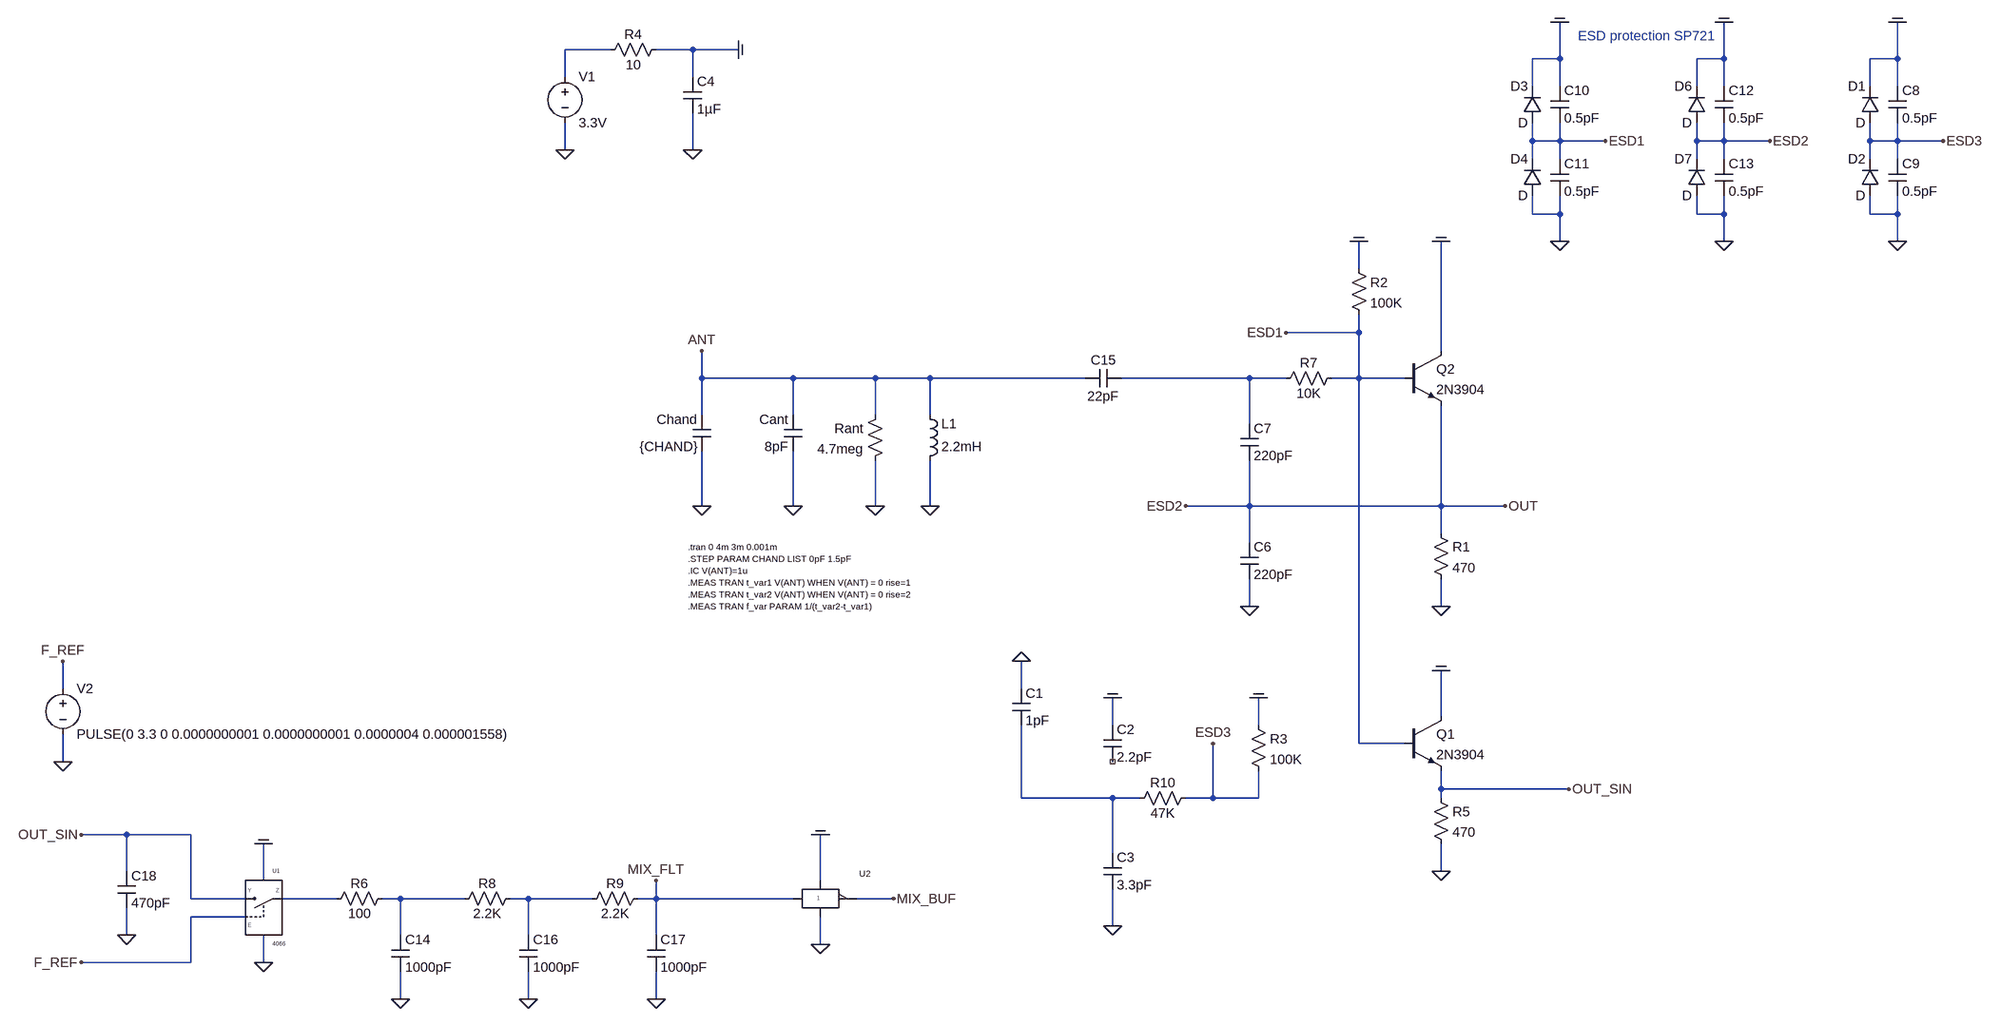
[diagram p0: schematic 2020_analog_oscill_sin_33v_v05_heter.asc]
2020_analog_oscill_sin_33v_v05_heter.asc, the LTspice schematic file:
Version 4
SHEET 1 2908 1572
WIRE -1232 -384 -1312 -384
WIRE -1088 -384 -1152 -384
WIRE -1008 -384 -1088 -384
WIRE 432 -368 432 -432
WIRE 432 -368 384 -368
WIRE 720 -368 720 -432
WIRE 720 -368 672 -368
WIRE 1024 -368 1024 -432
WIRE 1024 -368 976 -368
WIRE -1312 -336 -1312 -384
WIRE -1088 -336 -1088 -384
WIRE 384 -320 384 -368
WIRE 432 -320 432 -368
WIRE 672 -320 672 -368
WIRE 720 -320 720 -368
WIRE 976 -320 976 -368
WIRE 1024 -320 1024 -368
WIRE 384 -224 384 -256
WIRE 432 -224 432 -256
WIRE 432 -224 384 -224
WIRE 512 -224 432 -224
WIRE 672 -224 672 -256
WIRE 720 -224 720 -256
WIRE 720 -224 672 -224
WIRE 800 -224 720 -224
WIRE 976 -224 976 -256
WIRE 1024 -224 1024 -256
WIRE 1024 -224 976 -224
WIRE 1104 -224 1024 -224
WIRE -1312 -208 -1312 -256
WIRE -1088 -208 -1088 -272
WIRE 384 -192 384 -224
WIRE 432 -192 432 -224
WIRE 672 -192 672 -224
WIRE 720 -192 720 -224
WIRE 976 -192 976 -224
WIRE 1024 -192 1024 -224
WIRE 384 -96 384 -128
WIRE 432 -96 432 -128
WIRE 432 -96 384 -96
WIRE 672 -96 672 -128
WIRE 720 -96 720 -128
WIRE 720 -96 672 -96
WIRE 976 -96 976 -128
WIRE 1024 -96 1024 -128
WIRE 1024 -96 976 -96
WIRE 432 -48 432 -96
WIRE 720 -48 720 -96
WIRE 1024 -48 1024 -96
WIRE 80 0 80 -48
WIRE 80 112 80 80
WIRE 80 112 -48 112
WIRE 224 144 224 -48
WIRE -1072 192 -1072 144
WIRE -912 192 -1072 192
WIRE -768 192 -912 192
WIRE -672 192 -768 192
WIRE -400 192 -672 192
WIRE -112 192 -336 192
WIRE -48 192 -112 192
WIRE 80 192 80 112
WIRE 80 192 32 192
WIRE 160 192 80 192
WIRE -1072 256 -1072 192
WIRE -912 256 -912 192
WIRE -768 256 -768 192
WIRE -672 256 -672 192
WIRE -112 272 -112 192
WIRE -1072 416 -1072 320
WIRE -912 416 -912 320
WIRE -768 416 -768 336
WIRE -672 416 -672 336
WIRE -112 416 -112 336
WIRE -112 416 -224 416
WIRE 224 416 224 240
WIRE 224 416 -112 416
WIRE 336 416 224 416
WIRE 224 464 224 416
WIRE -112 480 -112 416
WIRE -112 592 -112 544
WIRE 224 592 224 544
WIRE -2192 736 -2192 688
WIRE -512 736 -512 688
WIRE 224 784 224 704
WIRE -352 800 -352 752
WIRE -96 800 -96 752
WIRE 80 832 80 192
WIRE 160 832 80 832
WIRE -2192 864 -2192 816
WIRE 224 912 224 880
WIRE 448 912 224 912
WIRE -512 928 -512 800
WIRE -352 928 -512 928
WIRE -304 928 -352 928
WIRE -176 928 -176 832
WIRE -176 928 -224 928
WIRE -96 928 -96 880
WIRE -96 928 -176 928
WIRE 224 928 224 912
WIRE -2080 992 -2160 992
WIRE -1968 992 -2080 992
WIRE -352 1024 -352 928
WIRE -2080 1056 -2080 992
WIRE 224 1056 224 1008
WIRE -1840 1072 -1840 1008
WIRE -864 1072 -864 992
WIRE -1968 1104 -1968 992
WIRE -1872 1104 -1968 1104
WIRE -1712 1104 -1808 1104
WIRE -1600 1104 -1632 1104
WIRE -1488 1104 -1600 1104
WIRE -1376 1104 -1408 1104
WIRE -1264 1104 -1376 1104
WIRE -1152 1104 -1152 1072
WIRE -1152 1104 -1184 1104
WIRE -912 1104 -1152 1104
WIRE -736 1104 -800 1104
WIRE -1872 1136 -1968 1136
WIRE -352 1152 -352 1088
WIRE -2080 1168 -2080 1120
WIRE -1600 1168 -1600 1104
WIRE -1376 1168 -1376 1104
WIRE -1152 1168 -1152 1104
WIRE -864 1184 -864 1136
WIRE -1968 1216 -1968 1136
WIRE -1968 1216 -2160 1216
WIRE -1840 1216 -1840 1168
WIRE -1600 1280 -1600 1232
WIRE -1376 1280 -1376 1232
WIRE -1152 1280 -1152 1232
FLAG -1312 -208 0
FLAG -1072 416 0
FLAG -1072 144 ANT
FLAG -768 416 0
FLAG -1008 -384 COM
FLAG 432 -48 0
FLAG 432 -432 COM
FLAG 512 -224 ESD1
FLAG 720 -48 0
FLAG 720 -432 COM
FLAG 800 -224 ESD2
FLAG 1024 -48 0
FLAG 1024 -432 COM
FLAG 1104 -224 ESD3
FLAG -912 416 0
FLAG -352 1152 0
FLAG -48 112 ESD1
FLAG -176 832 ESD3
FLAG -96 752 COM
FLAG -352 752 COM
FLAG 224 1056 0
FLAG 224 704 COM
FLAG 448 912 OUT_SIN
FLAG -1088 -208 0
FLAG -672 416 0
FLAG 224 592 0
FLAG 224 -48 COM
FLAG 336 416 OUT
FLAG 80 -48 COM
FLAG -112 592 0
FLAG -224 416 ESD2
FLAG -2160 992 OUT_SIN
FLAG -2160 1216 F_REF
FLAG -1840 1008 COM
FLAG -1840 1216 0
FLAG -1600 1280 0
FLAG -1376 1280 0
FLAG -1152 1280 0
FLAG -1152 1072 MIX_FLT
FLAG -2192 864 0
FLAG -2192 688 F_REF
FLAG -2080 1168 0
FLAG -864 992 COM
FLAG -864 1184 0
FLAG -736 1104 MIX_BUF
FLAG -512 688 0
SYMBOL voltage -1312 -352 R0
WINDOW 123 0 0 Left 2
WINDOW 39 0 0 Left 2
SYMATTR InstName V1
SYMATTR Value 3.3V
SYMBOL ind -688 352 M180
WINDOW 0 36 80 Left 2
WINDOW 3 36 40 Left 2
SYMATTR InstName L1
SYMATTR Value 2.2mH
SYMATTR SpiceLine Ipk=0.1 Rser=69 Rpar=1.536Meg Cpar=1.147pF
SYMBOL cap -1056 256 M0
SYMATTR InstName Chand
SYMATTR Value {CHAND}
SYMBOL res -752 240 M0
SYMATTR InstName Rant
SYMATTR Value 4.7meg
SYMBOL diode 400 -256 R180
WINDOW 0 24 64 Left 2
WINDOW 3 24 0 Left 2
SYMATTR InstName D3
SYMBOL diode 400 -128 R180
WINDOW 0 24 64 Left 2
WINDOW 3 24 0 Left 2
SYMATTR InstName D4
SYMBOL cap 416 -320 R0
SYMATTR InstName C10
SYMATTR Value 0.5pF
SYMBOL cap 416 -192 R0
SYMATTR InstName C11
SYMATTR Value 0.5pF
SYMBOL diode 688 -256 R180
WINDOW 0 24 64 Left 2
WINDOW 3 24 0 Left 2
SYMATTR InstName D6
SYMBOL diode 688 -128 R180
WINDOW 0 24 64 Left 2
WINDOW 3 24 0 Left 2
SYMATTR InstName D7
SYMBOL cap 704 -320 R0
SYMATTR InstName C12
SYMATTR Value 0.5pF
SYMBOL cap 704 -192 R0
SYMATTR InstName C13
SYMATTR Value 0.5pF
SYMBOL diode 992 -256 R180
WINDOW 0 24 64 Left 2
WINDOW 3 24 0 Left 2
SYMATTR InstName D1
SYMBOL diode 992 -128 R180
WINDOW 0 24 64 Left 2
WINDOW 3 24 0 Left 2
SYMATTR InstName D2
SYMBOL cap 1008 -320 R0
SYMATTR InstName C8
SYMATTR Value 0.5pF
SYMBOL cap 1008 -192 R0
SYMATTR InstName C9
SYMATTR Value 0.5pF
SYMBOL cap -896 256 M0
SYMATTR InstName Cant
SYMATTR Value 8pF
SYMBOL cap -528 736 R0
SYMATTR InstName C1
SYMATTR Value 1pF
SYMBOL cap -368 1024 R0
SYMATTR InstName C3
SYMATTR Value 3.3pF
SYMBOL res -112 784 R0
SYMATTR InstName R3
SYMATTR Value 100K
SYMBOL cap -368 800 R0
SYMATTR InstName C2
SYMATTR Value 2.2pF
SYMBOL npn 160 784 R0
SYMATTR InstName Q1
SYMATTR Value 2N3904
SYMBOL res 208 912 R0
SYMATTR InstName R5
SYMATTR Value 470
SYMBOL res -1136 -400 R90
WINDOW 0 5 56 VBottom 2
WINDOW 3 27 56 VTop 2
SYMATTR InstName R4
SYMATTR Value 10
SYMBOL cap -1104 -336 R0
SYMATTR InstName C4
SYMATTR Value 1µF
SYMBOL npn 160 144 R0
SYMATTR InstName Q2
SYMATTR Value 2N3904
SYMBOL res 208 448 R0
SYMATTR InstName R1
SYMATTR Value 470
SYMBOL cap -128 480 R0
SYMATTR InstName C6
SYMATTR Value 220pF
SYMBOL cap -128 272 R0
SYMATTR InstName C7
SYMATTR Value 220pF
SYMBOL res 64 -16 R0
SYMATTR InstName R2
SYMATTR Value 100K
SYMBOL cap -336 176 R90
WINDOW 0 0 32 VBottom 2
WINDOW 3 32 32 VTop 2
SYMATTR InstName C15
SYMATTR Value 22pF
SYMBOL res 48 176 R90
WINDOW 0 5 56 VBottom 2
WINDOW 3 27 56 VTop 2
SYMATTR InstName R7
SYMATTR Value 10K
SYMBOL Dig_Add\\CD4xxx\\cd4066 -1840 1120 R0
SYMATTR InstName U1
SYMBOL cap -1616 1168 R0
SYMATTR InstName C14
SYMATTR Value 1000pF
SYMBOL res -1616 1088 R90
WINDOW 0 5 56 VBottom 2
WINDOW 3 27 56 VTop 2
SYMATTR InstName R6
SYMATTR Value 100
SYMBOL cap -1392 1168 R0
SYMATTR InstName C16
SYMATTR Value 1000pF
SYMBOL res -1392 1088 R90
WINDOW 0 5 56 VBottom 2
WINDOW 3 27 56 VTop 2
SYMATTR InstName R8
SYMATTR Value 2.2K
SYMBOL cap -1168 1168 R0
SYMATTR InstName C17
SYMATTR Value 1000pF
SYMBOL res -1168 1088 R90
WINDOW 0 5 56 VBottom 2
WINDOW 3 27 56 VTop 2
SYMATTR InstName R9
SYMATTR Value 2.2K
SYMBOL voltage -2192 720 R0
WINDOW 123 0 0 Left 2
WINDOW 39 0 0 Left 2
SYMATTR InstName V2
SYMATTR Value PULSE(0 3.3 0 0.0000000001 0.0000000001 0.0000004 0.000001558)
SYMBOL cap -2096 1056 R0
SYMATTR InstName C18
SYMATTR Value 470pF
SYMBOL SBORKA\\Logika\\74AHC1G04 -864 1056 R0
SYMATTR InstName U2
SYMBOL res -208 912 R90
WINDOW 0 5 56 VBottom 2
WINDOW 3 27 56 VTop 2
SYMATTR InstName R10
SYMATTR Value 47K
TEXT -1096 488 Left 1 !.tran 0 4m 3m 0.001m\n.STEP PARAM CHAND LIST 0pF 1.5pF\n.IC V(ANT)=1u\n.MEAS TRAN t_var1 V(ANT) WHEN V(ANT) = 0 rise=1\n.MEAS TRAN t_var2 V(ANT) WHEN V(ANT) = 0 rise=2\n.MEAS TRAN f_var PARAM 1/(t_var2-t_var1)
TEXT 464 -408 Left 2 ;ESD protection SP721

The netlist it stands for:
* 2020_analog_oscill_sin_33v_v05_heter.asc
V1 N001 0 3.3V
L1 0 ANT 2.2mH Ipk=0.1 Rser=69 Rpar=1.536Meg Cpar=1.147pF
Chand ANT 0 {CHAND}
Rant ANT 0 4.7meg
D3 ESD1 COM D
D4 0 ESD1 D
C10 COM ESD1 0.5pF
C11 ESD1 0 0.5pF
D6 OUT COM D
D7 0 OUT D
C12 COM OUT 0.5pF
C13 OUT 0 0.5pF
D1 ESD3 COM D
D2 0 ESD3 D
C8 COM ESD3 0.5pF
C9 ESD3 0 0.5pF
Cant ANT 0 8pF
C1 0 N003 1pF
C3 N003 0 3.3pF
R3 COM ESD3 100K
C2 COM NC_01 2.2pF
Q1 COM ESD1 OUT_SIN 0 2N3904
R5 OUT_SIN 0 470
R4 COM N001 10
C4 COM 0 1µF
Q2 COM ESD1 OUT 0 2N3904
R1 OUT 0 470
C6 OUT 0 220pF
C7 N002 OUT 220pF
R2 COM ESD1 100K
C15 N002 ANT 22pF
R7 ESD1 N002 10K
XU1 OUT_SIN N004 F_REF COM 0 4066  ; pins Y OUT EN VCC VSS
C14 N005 0 1000pF
R6 N005 N004 100
C16 N006 0 1000pF
R8 N006 N005 2.2K
C17 MIX_FLT 0 1000pF
R9 MIX_FLT N006 2.2K
V2 F_REF 0 PULSE(0 3.3 0 0.0000000001 0.0000000001 0.0000004 0.000001558)
C18 OUT_SIN 0 470pF
XU2 MIX_FLT MIX_BUF COM 0 74AHC1G04  ; pins in out vcc gnd
R10 ESD3 N003 47K
.model D D
.lib standard.dio
.model NPN NPN
.model PNP PNP
.lib standard.bjt
.tran 0 4m 3m 0.001m
.STEP PARAM CHAND LIST 0pF 1.5pF
.IC V(ANT)=1u
.MEAS TRAN t_var1 V(ANT) WHEN V(ANT) = 0 rise=1
.MEAS TRAN t_var2 V(ANT) WHEN V(ANT) = 0 rise=2
.MEAS TRAN f_var PARAM 1/(t_var2-t_var1)
* ESD protection SP721
.lib SwitchAna.lib
.lib 74AHC1G04.cir
.backanno
.end